# Altium schematic sheet Block_Diagram.SchDoc
size A4
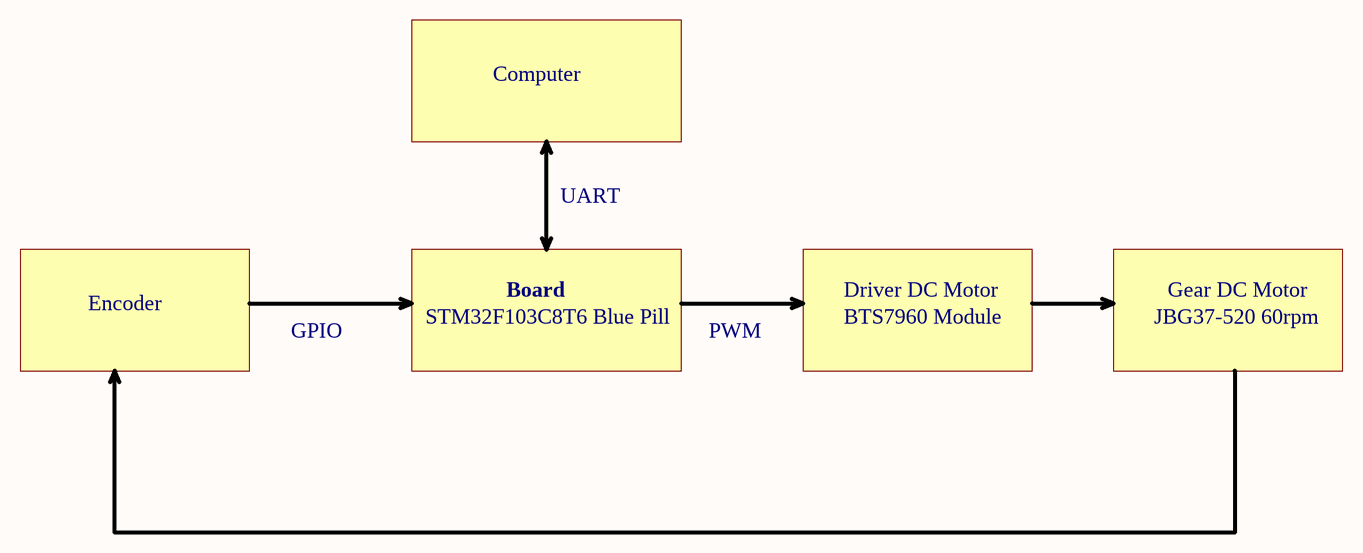
[diagram p0: Block_Diagram.SchDoc]

## Notes on the sheet
- Computer
- UART
- Encoder
- GPIO
- STM32F103C8T6 Blue Pill
- Board
- PWM
- Driver DC Motor
- BTS7960 Module
- JBG37-520 60rpm
- Gear DC Motor